# EAGLE design landyatch (EAGLE 5.10)
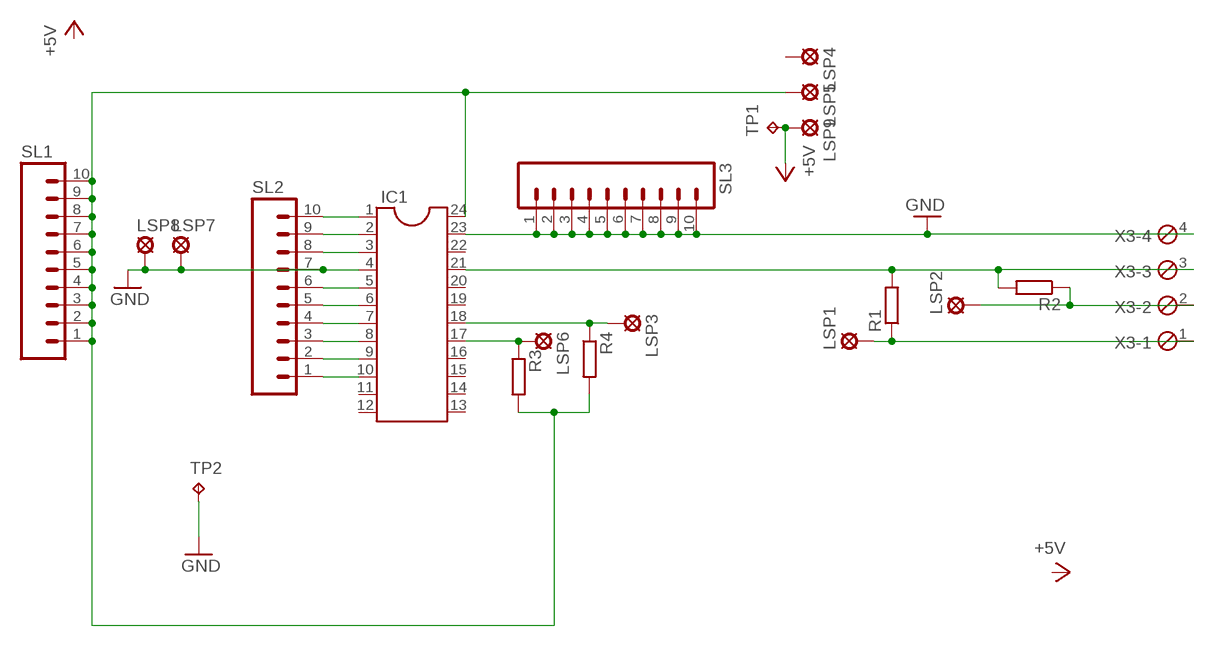
[diagram p0: schematic, sheet 1]

## Parts
IC1  DIL24-6  [DIL24-6]
LSP1  MCS08  [MCS08]
LSP2  MCS08  [MCS08]
LSP3  MCS08  [MCS08]
LSP4  SE13  [SE13]
LSP5  SE13  [SE13]
LSP6  MCS08  [MCS08]
LSP7  MCS08  [MCS08]
LSP8  MCS08  [MCS08]
LSP9  SE13  [SE13]
R1  R-EU_R0805  [R0805]
R2  R-EU_R0805  [R0805]
R3  R-EU_R0805  [R0805]
R4  R-EU_R0805  [R0805]
SL1  M10  [10P]
SL2  M10  [10P]
SL3  M10  [10P]
TP1  TPTP17SQ  [TP17SQ]
TP2  TPTP17SQ  [TP17SQ]
X3  MPT4  [4POL254]

## Nets
+5V: LSP9.MP TP1.TP
GND: IC1.4 IC1.23 LSP7.MP LSP8.MP SL2.7 SL3.1 SL3.2 SL3.3 SL3.4 SL3.5 SL3.6 SL3.7 SL3.8 SL3.9 SL3.10 TP2.TP X3.4
N$6: LSP1.MP R1.1 X3.1
N$7: IC1.21 R1.2 R2.2 X3.3
N$9: LSP2.MP R2.1 X3.2
N$16: IC1.18 LSP3.MP R4.1
N$17: IC1.17 LSP6.MP R3.1
N$18: IC1.10 SL2.1
N$19: IC1.24 LSP5.MP R3.2 R4.2 SL1.1 SL1.2 SL1.3 SL1.4 SL1.5 SL1.6 SL1.7 SL1.8 SL1.9 SL1.10
N$20: IC1.9 SL2.2
N$21: IC1.8 SL2.3
N$22: IC1.7 SL2.4
N$23: IC1.6 SL2.5
N$24: IC1.5 SL2.6
N$25: IC1.3 SL2.8
N$26: IC1.2 SL2.9
N$27: IC1.1 SL2.10
Unconnected: IC1.11 IC1.12 IC1.13 IC1.14 IC1.15 IC1.16 IC1.19 IC1.20 IC1.22 LSP4.MP

## Library data of the parts
IC1 = ic-package:DIL24: Dual In Line
LSP1-LSP3 LSP6-LSP8 = solpad:MCS08: SOLDER PAD MC S0,8, drill 1.2 mm, distributor Buerklin, 08F130
LSP4 LSP5 LSP9 = solpad:SE13: SOLDER PAD E1542, drill 1,3mm, distributor Buerklin, 07F815
R1-R4 = rcl:R-EU_: RESISTOR, European symbol
SL1-SL3 = con-amp-quick:M10: AMP QUICK CONNECTOR
TP1 TP2 = testpad:TP: Test pad
X3 = con-phoenix-254:MPT4: PHOENIX CONNECTOR

## Board
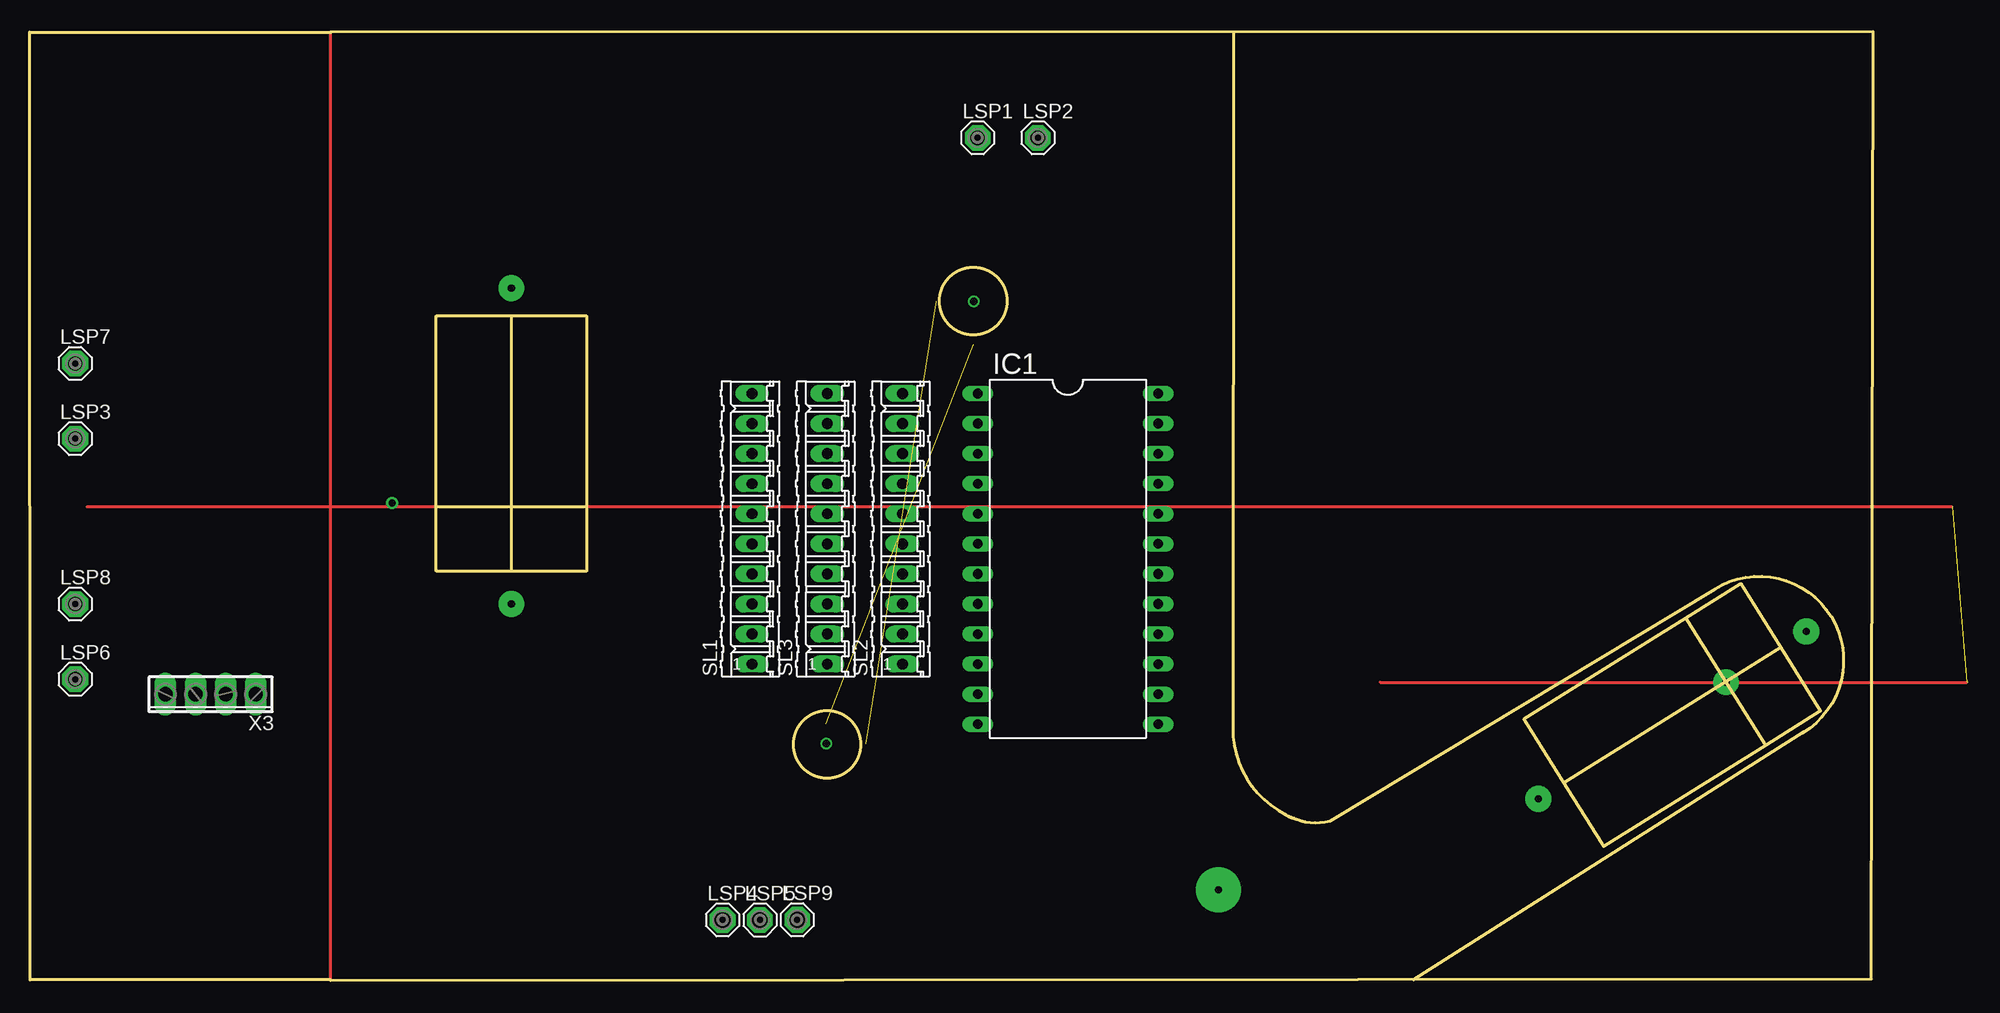
[diagram p1: board, top side]
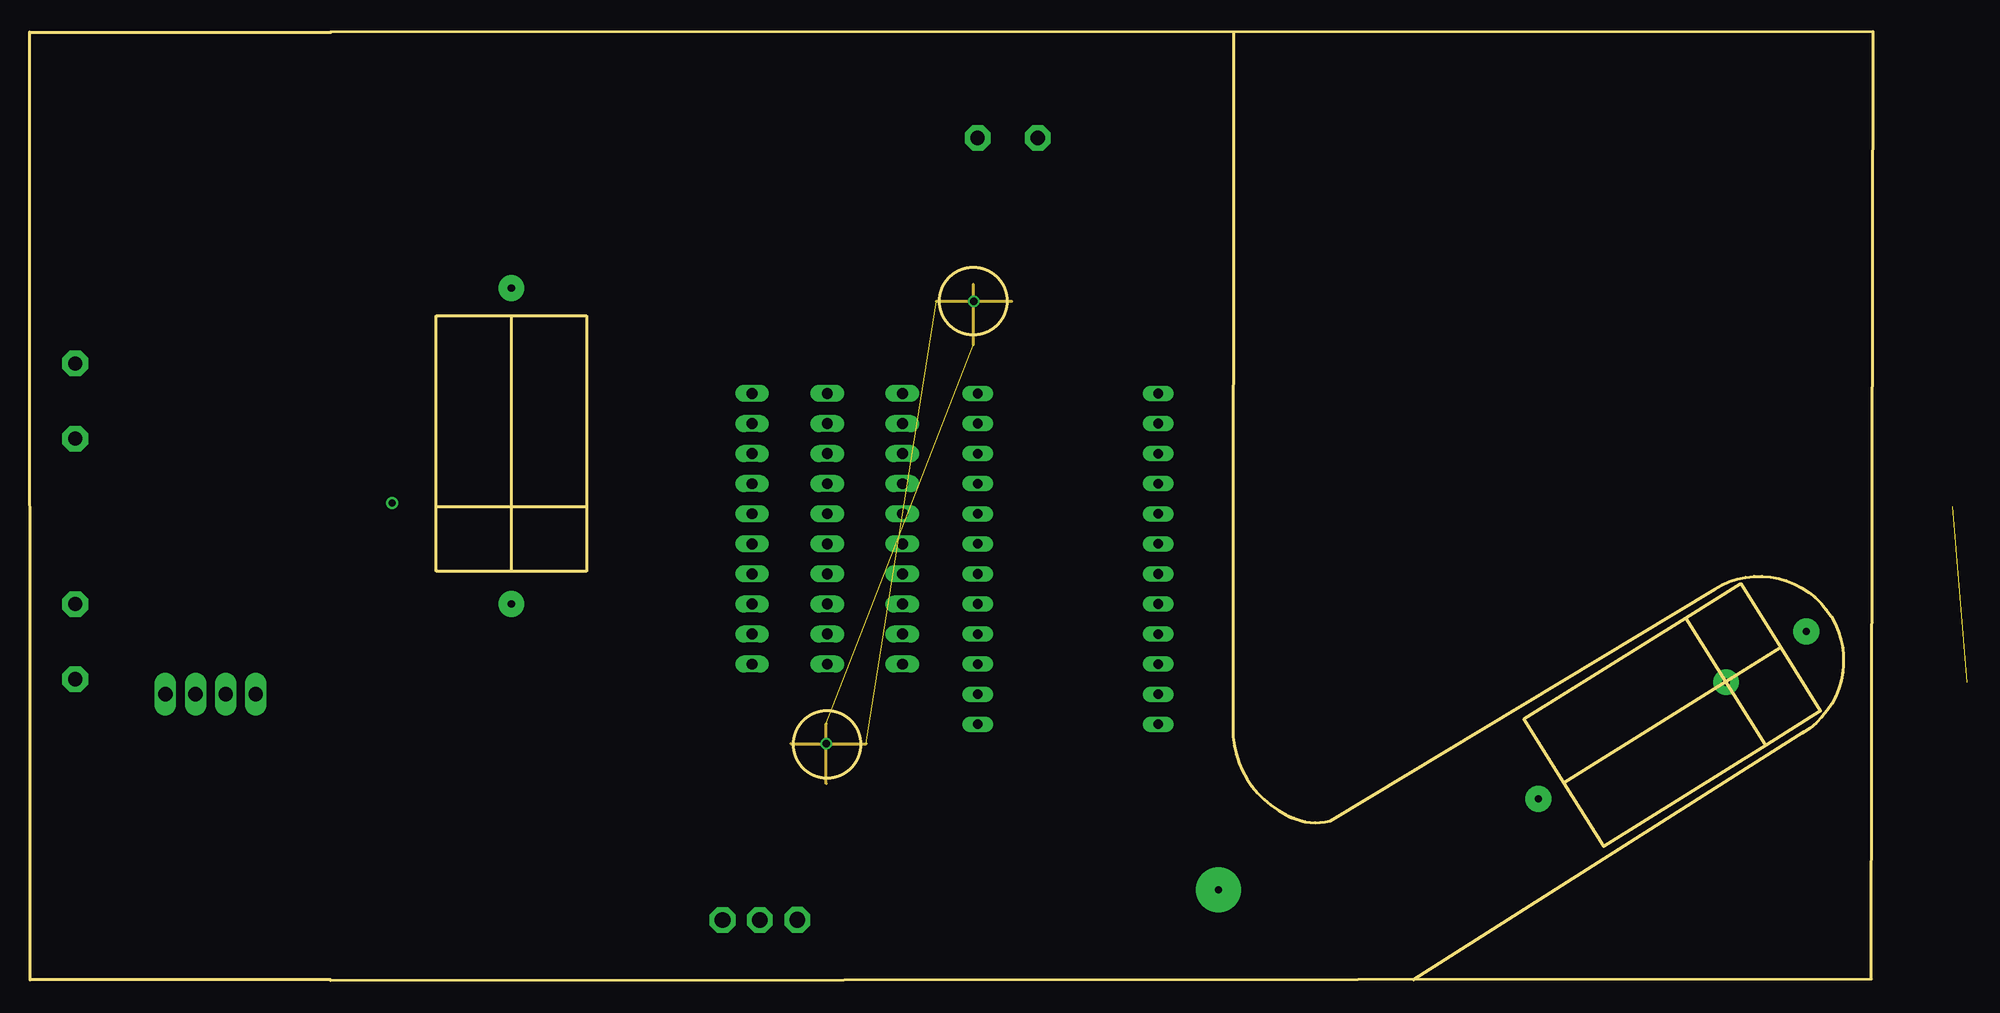
[diagram p2: board, inner layer Route2]
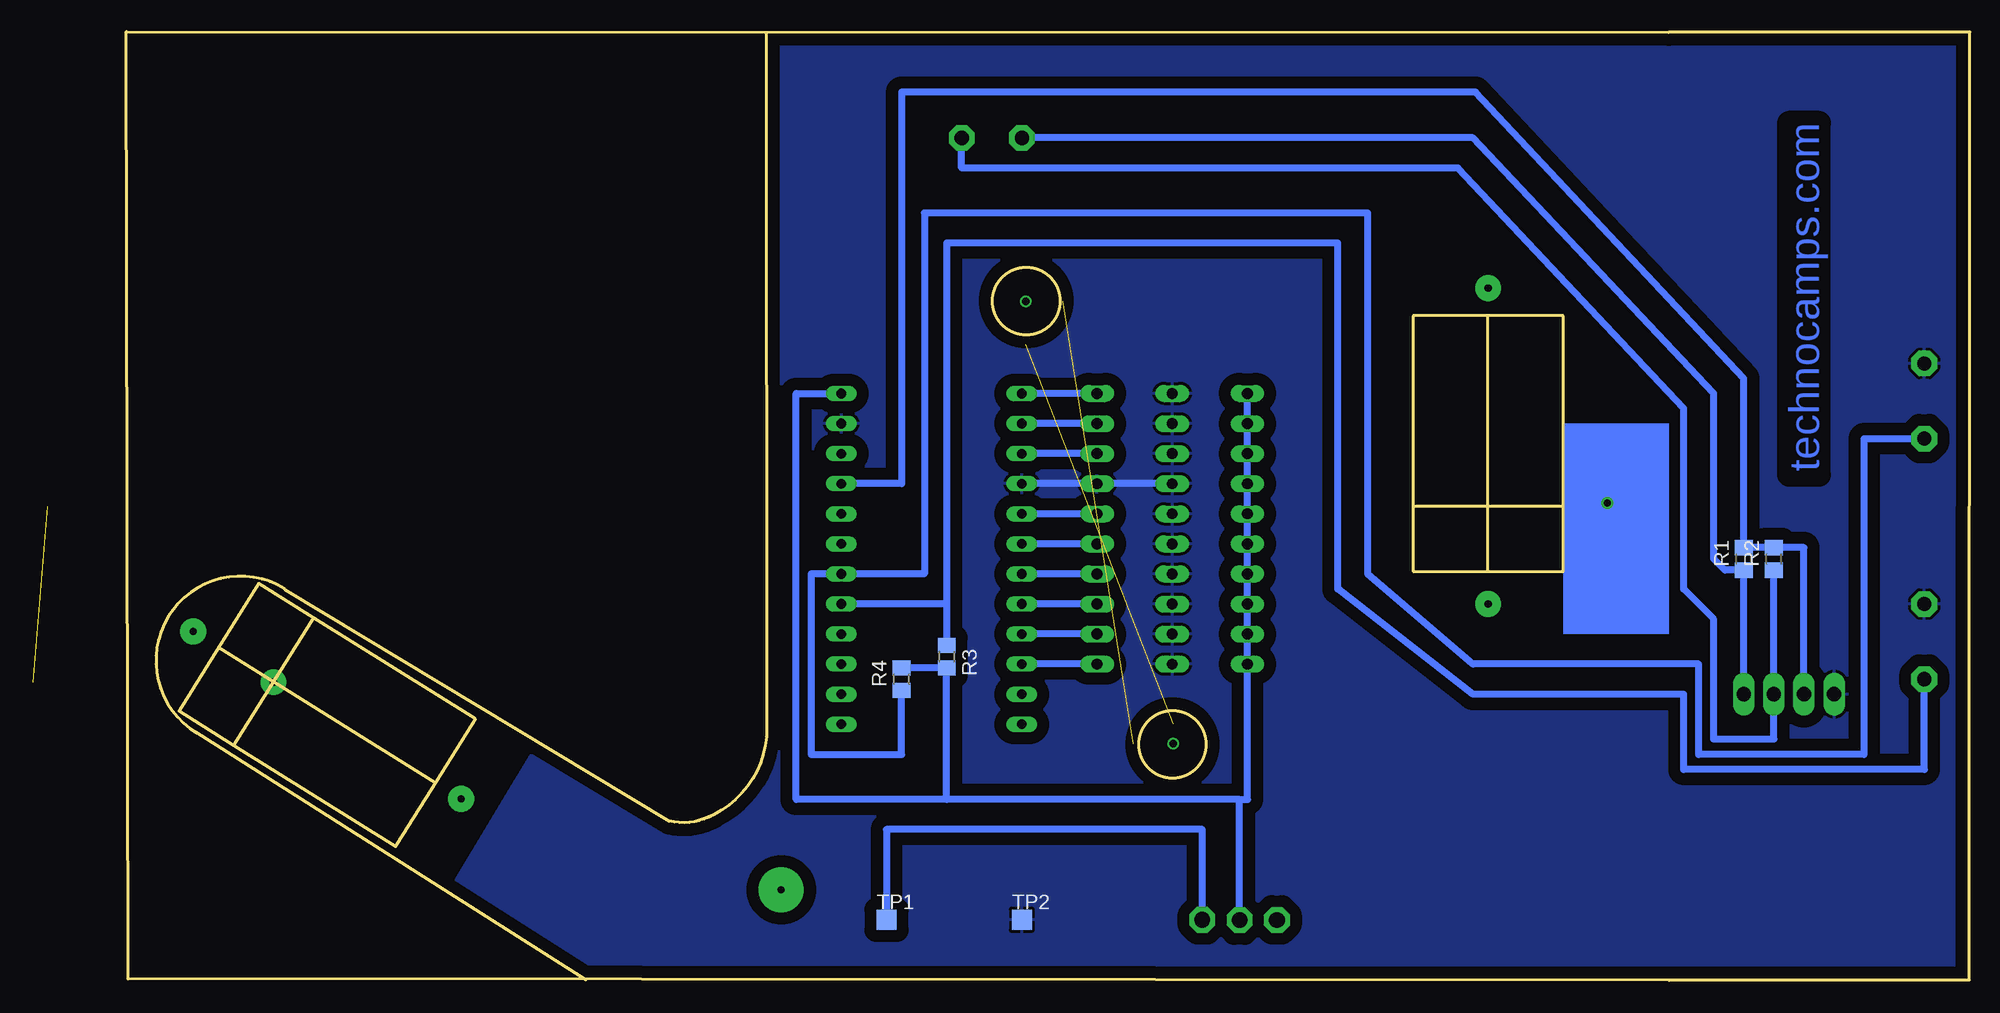
[diagram p3: board, bottom side, seen from below]

Size 155.66 x 80.13 mm. Coordinates in mm from the lower left corner, seen from the top.
Outline: 25.42,0 155.51,0.12 155.66,80.13 25.44,80.07
Outline: 40.68,56.13 34.33,56.13 34.33,40
Outline: 40.68,56.13 47.03,56.13 47.03,40
Outline: 47.03,40 47.03,34.54 40.68,34.54
Outline: 40.68,34.54 34.33,34.54 34.33,40
Outline: 34.33,40 47.03,40
Outline: 40.68,34.54 40.68,56.13
Outline: 129.55,16.68 132.91,11.3 146.59,19.84
Outline: 129.55,16.68 126.18,22.07 139.86,30.61
Outline: 139.86,30.61 144.49,33.51 147.86,28.12
Outline: 147.86,28.12 151.22,22.74 146.59,19.84
Outline: 146.59,19.84 139.86,30.61
Outline: 147.86,28.12 129.55,16.68
Outline: 25.44,0.03 0.04,0.03 0,80.08 25.4,80.08
Outline: 101.64,80.04 101.62,20.56 arc69 107.5,13.44
Outline: 142.31,33.03 109.78,13.44
Outline: 149.82,20.98 116.85,0.04
Outline: 142.28,33.05 arc-181 149.73,20.89
Outline: 106.1,13.97 arc43 109.83,13.46
Outline: circle at 79.69,57.37 radius 2.84
Outline: circle at 67.33,19.92 radius 2.84
Copper layers (1*16): Top 0.035mm / dielectric 1.5mm / Bottom 0.035mm
Design rules "default *": minimum track width 10mil, minimum drill 24mil, track to track 40mil, track to pad 40mil, pad to pad 8mil, via to via 40mil, smd to smd 8mil, copper to edge 40mil, drill to drill 8mil, minimum pad ring 10mil, minimum via ring 8mil, stop-mask expansion 4mil, vias tented up to drill 0mil, thermal gap 10mil

### Footprints (pad centres in the part's own frame; a part is rotated, then mirrored left to right if it is on the bottom)
DIL24-6 = drill 0.813 long: 1 -13.97,-7.62; 2 -11.43,-7.62; 3 -8.89,-7.62; 4 -6.35,-7.62; 5 -3.81,-7.62; 6 -1.27,-7.62; 7 1.27,-7.62; 8 3.81,-7.62; 9 6.35,-7.62; 10 8.89,-7.62; 11 11.43,-7.62; 12 13.97,-7.62; 13 13.97,7.62; 14 11.43,7.62; 15 8.89,7.62; 16 6.35,7.62; 17 3.81,7.62; 18 1.27,7.62; 19 -1.27,7.62; 20 -3.81,7.62; 21 -6.35,7.62; 22 -8.89,7.62; 23 -11.43,7.62; 24 -13.97,7.62
MCS08 = drill 1.194 pad 2.159 octagon: MP 0,0
SE13 = drill 1.321 pad 2.159 octagon: MP 0,0
R0805 = smd 1.3 x 1.5: 1 -0.95,0; 2 0.95,0
10P = drill 0.914 long: 1 -11.43,0; 2 -8.89,0; 3 -6.35,0; 4 -3.81,0; 5 -1.27,0; 6 1.27,0; 7 3.81,0; 8 6.35,0; 9 8.89,0; 10 11.43,0
TP17SQ = smd 1.7 x 1.7: TP 0,0
4POL254 = drill 1.2 long: 1 -3.81,0; 2 -1.27,0; 3 1.27,0; 4 3.81,0

### Placement (x,y rotation side)
IC1  87.67,35.59 270 top
LSP1  80.05,71.15 0 top
LSP2  85.13,71.15 0 top
LSP3  3.85,45.75 0 top
LSP4  58.51,5.1 0 top
LSP5  61.67,5.09 0 top
LSP6  3.85,25.43 0 top
LSP7  3.85,52.1 0 top
LSP8  3.85,31.78 0 top
LSP9  64.81,5.11 0 top
R1  19.09,35.59 90 bottom
R2  16.55,35.59 90 bottom
R3  86.4,27.33 270 bottom
R4  90.21,25.43 90 bottom
SL1  61,38.13 90 top
SL2  73.7,38.13 90 top
SL3  67.35,38.13 90 top
TP1  91.48,5.11 0 bottom
TP2  80.05,5.11 0 bottom
X3  15.28,24.16 180 top

### Tracks (layer width: path | path; a pad name or v marks a point on that pad's centre or on a via)
+5V
  Bottom 0.61: TP1.TP 91.48,12.73 64.81,12.73 LSP9.MP
GND
  Bottom 0.61: IC1.4 SL2.7 SL3.7
  pour Bottom: 0.04,0.03 0.04,80.04 101.64,80.04 101.64,21.62 arc113 111.8,14 120.69,20.35 128.31,7.65 116.88,0.03
N$1  (1 unrouted)
  Route2 0.254: 64.28,19.98 70.63,19.98 | 76.56,57.36 82.91,57.36
N$2  (1 unrouted)
  Top 0.254: 4.85,40.01 162.33,40.01 | 114.05,25.16 163.58,25.16
N$3  (1 unrouted)
  Route2 0.254: 67.25,16.59 67.25,21.67 | 79.7,53.68 79.7,58.76
N$4  (via drill 0.6)
  other vias: 67.27,19.99
N$5  (via drill 0.6)
  other vias: 79.72,57.34
N$6
  Bottom 0.61: LSP1.MP 41.95,71.15 21.63,49.56 21.63,35.59 20.68,34.64 R1.1 X3.1
N$7
  Bottom 0.61: X3.3 14.01,36.54 R2.2 R1.2 19.09,50.83 41.75,75.01 90.21,75.01 90.21,41.94 IC1.21
N$8  (via drill 0.6)
  other vias: 30.62,40.31
N$9
  Bottom 0.61: R2.1 X3.2 16.55,20.35 21.63,20.35 21.63,30.51 24.17,33.05 24.17,48.29 43.22,68.61 85.13,68.61 LSP2.MP
N$10  (via drill 0.6 pad 2.18)
  other vias: 40.68,31.78
N$11  (via drill 0.6 pad 2.18)
  other vias: 40.68,58.45
N$12  (via drill 0.6 pad 2.18)
  other vias: 127.39,15.33
N$13  (via drill 0.6 pad 2.18)
  other vias: 150.01,29.47
N$14  (via drill 0.6 pad 2.18)
  other vias: 143.25,25.18
N$15
  Top 0.254: 25.44,0.03 25.44,80.04
N$16
  Bottom 0.61: LSP3.MP 8.93,45.75 8.93,19.08 22.9,19.08 22.9,26.7 41.95,26.7 50.84,34.32 50.84,64.8 88.29,64.8 88.29,34.32 IC1.18 97.83,34.32 97.83,19.08 90.21,19.08 R4.1
N$17
  Bottom 0.61: LSP6.MP 3.85,17.81 24.17,17.81 24.17,24.16 41.95,24.16 53.38,33.05 53.38,62.26 86.4,62.26 86.4,31.78 | 86.4,31.78 IC1.17 | 86.4,31.78 R3.1
N$18
  Bottom 0.61: SL2.1 IC1.10
N$19
  Bottom 0.61: LSP5.MP 61.67,15.27 | SL1.10 SL1.9 SL1.8 SL1.7 SL1.6 SL1.5 SL1.4 SL1.3 SL1.2 SL1.1 61,15.27 61.67,15.27 | 86.4,15.27 R3.2 R4.2 | 61.67,15.27 86.4,15.27 | IC1.24 99.1,49.56 99.1,15.27 86.4,15.27
N$20
  Bottom 0.61: SL2.2 IC1.9
N$21
  Bottom 0.61: SL2.3 IC1.8
N$22
  Bottom 0.61: SL2.4 IC1.7
N$23
  Bottom 0.61: SL2.5 IC1.6
N$24
  Bottom 0.61: SL2.6 IC1.5
N$25
  Bottom 0.61: SL2.8 IC1.3
N$26
  Bottom 0.61: SL2.9 IC1.2
N$27
  Bottom 0.61: SL2.10 IC1.1
N$28  (via drill 0.6 pad 3.81)
  other vias: 100.37,7.65
(copper drawn outside any net)
  shapes: Bottom area x1

### Text on the board
Bottom: technocamps.com